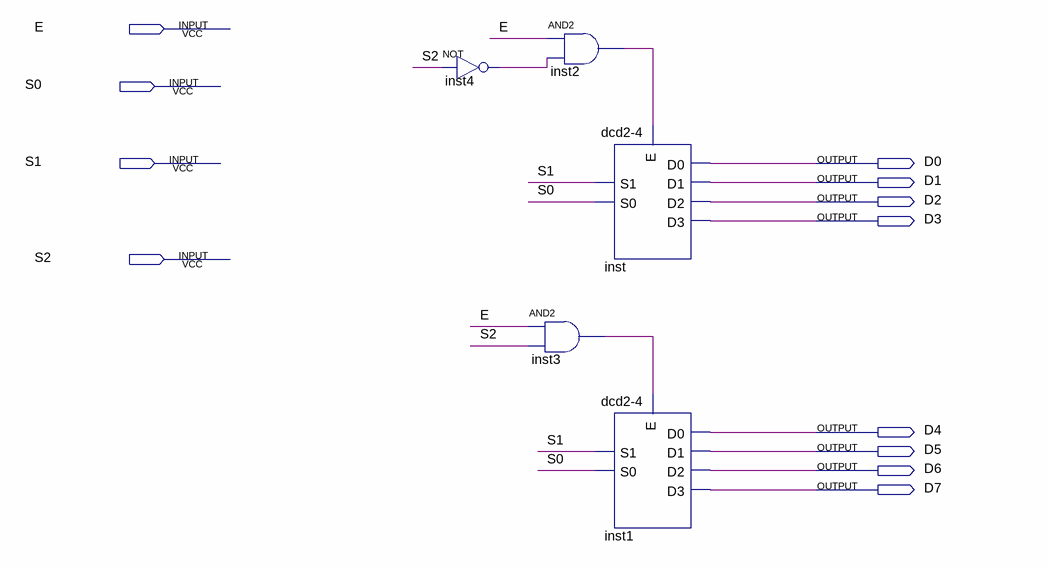
[diagram p0: schematic sheet]
// Quartus schematic dcd3-8.bdf as structural Verilog: 5 symbols, 12 pins
module \dcd3-8  (
  input  E,
  input  S0,
  input  S1,
  input  S2,
  output D0,
  output D1,
  output D2,
  output D3,
  output D4,
  output D5,
  output D6,
  output D7
);

  wire inst2_out, inst3_out, inst4_out;

  not inst4 (inst4_out, S2);
  and inst2 (inst2_out, E, inst4_out);
  and inst3 (inst3_out, E, S2);
  \dcd2-4  inst (.E(inst2_out), .S1(S1), .S0(S0), .D0(D0), .D1(D1), .D2(D2), .D3(D3));
  \dcd2-4  inst1 (.E(inst3_out), .S1(S1), .S0(S0), .D0(D4), .D1(D5), .D2(D6), .D3(D7));
endmodule
